# Altium schematic sheet Current_Amplifier_PCB.SchDoc
size A4
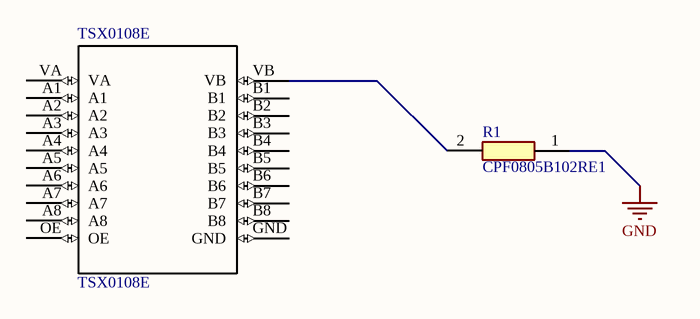
[diagram p0: Current_Amplifier_PCB.SchDoc]

## Parts
R1  CPF0805B102RE1  [RESC2012X65N]
TSX0108E  TSX0108E  [PCBComponent_1]

## Nets
GND: R1.1
NetR1_2: R1.2 TSX0108E.VB

Not connected (* = marked no-connect by the designer): TSX0108E A1 A2 A3 A4 A5 A6 A7 A8 B1 B2 B3 B4 B5 B6 B7 B8 GND OE VA

## Library data of the parts
R1 = CPF0805B102RE1: Resistor; Manufacturer_Name: TE Connectivity; Datasheet Link: http://docs-europe.electrocomponents.com/webdocs/13d1/0900766b813d116f.pdf; Height: 0.65mm; Manufacturer_Part_Number: CPF0805B102RE1